# EAGLE schematic Hovercraft (EAGLE 9.3.0)
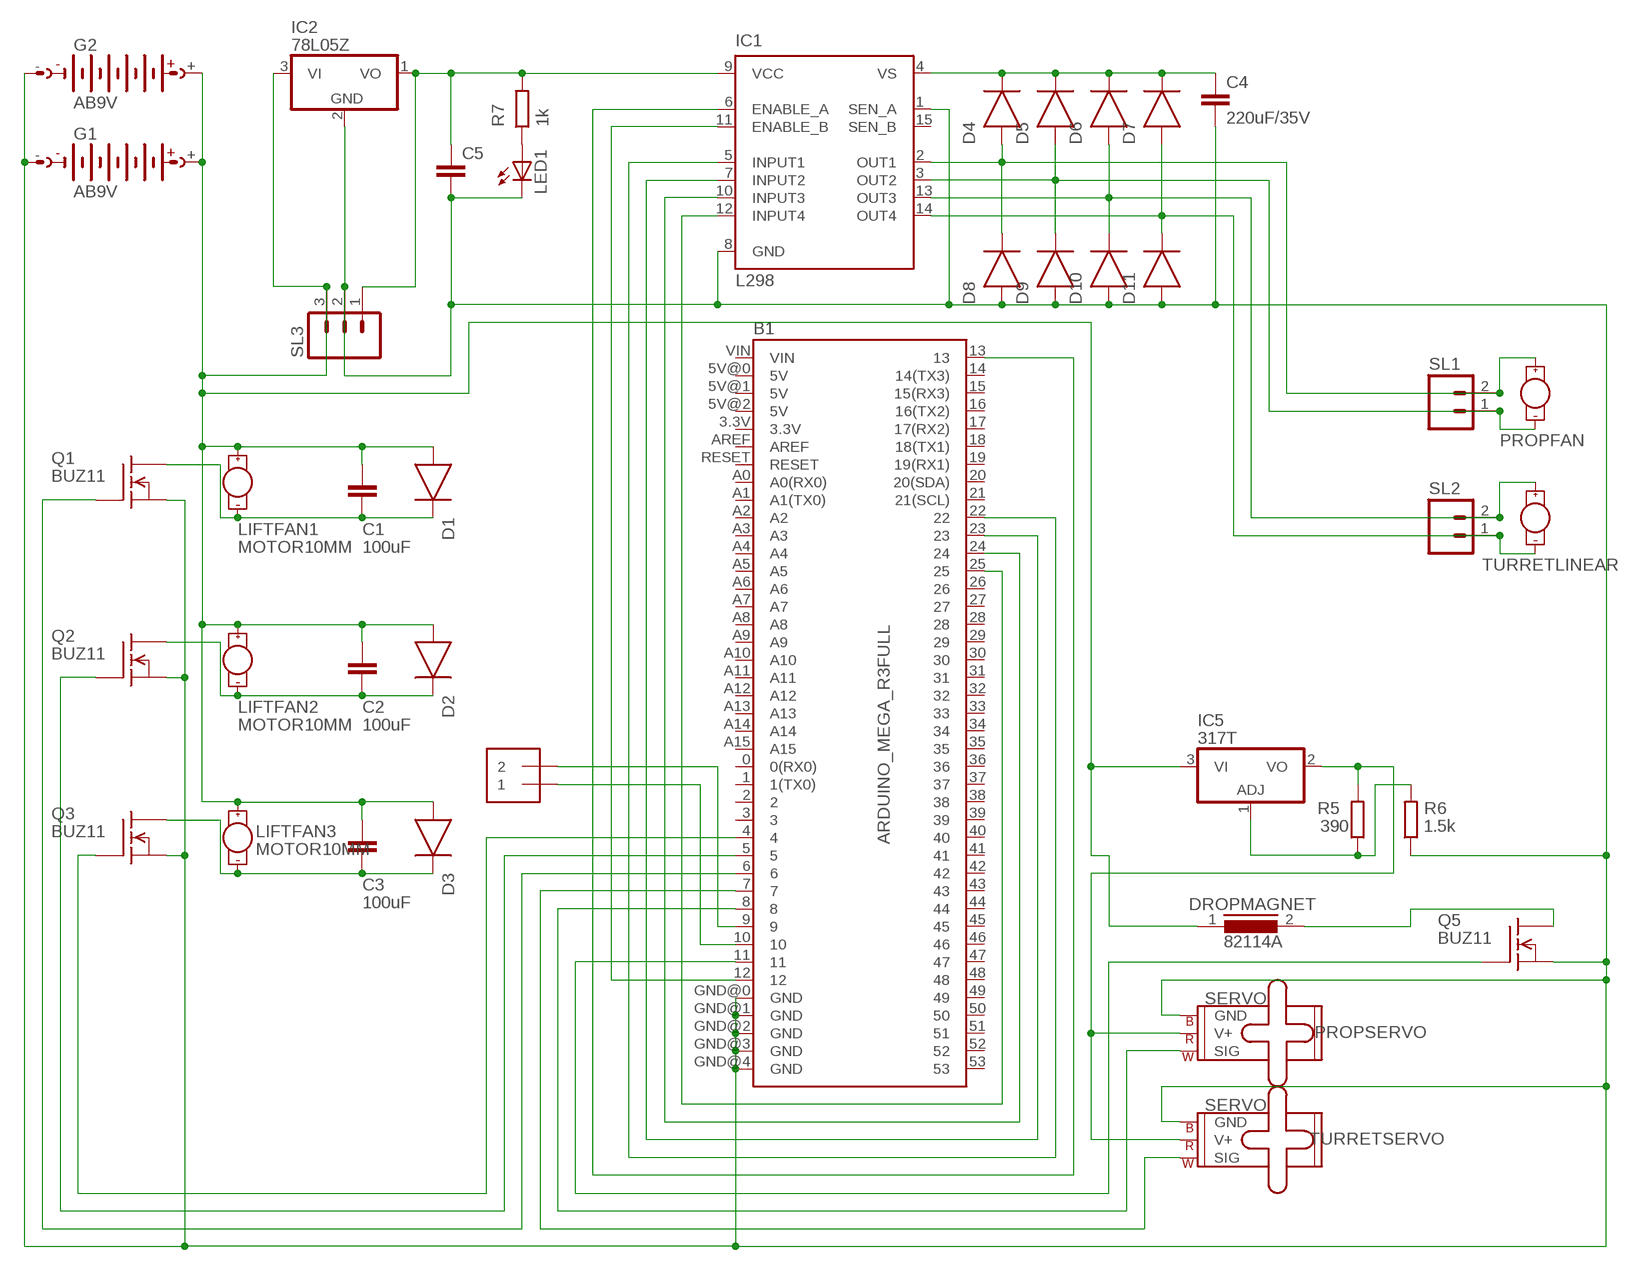
[diagram p0: schematic, sheet 1]

## Parts
B1  ARDUINO_MEGA_R3FULL  [ARDUINO_MEGA]
C1  100uF  C  (no package)
C2  100uF  C  (no package)
C3  100uF  C  (no package)
C4  220uF/35V  C2,5-3  [C2.5-3]
C5  C2,5-3  [C2.5-3]
D1  DIODE  (no package)
D2  DIODE  (no package)
D3  DIODE  (no package)
D4  DIODE  (no package)
D5  DIODE  (no package)
D6  DIODE  (no package)
D7  DIODE  (no package)
D8  DIODE  (no package)
D9  DIODE  (no package)
D10  DIODE  (no package)
D11  DIODE  (no package)
DROPMAGNET  82114A  [82114A]
G1  AB9V  [AB9V]
G2  AB9V  [AB9V]
HOSTSHIELD  1X2-3.5MM  [1X2-3.5MM]
IC1  L298  [MULTIWATT-15]
IC2  78L05Z  [TO92]
IC5  317T  [TO220H]
LED1  LED3MM  [LED3MM]
LIFTFAN1  MOTOR10MM  [VIBE-MOTOR-10MM]
LIFTFAN2  MOTOR10MM  [VIBE-MOTOR-10MM]
LIFTFAN3  MOTOR10MM  [VIBE-MOTOR-10MM]
PROPFAN  MOTOR10MM  [VIBE-MOTOR-10MM]
PROPSERVO  SERVO  [1X03]
Q1  BUZ11  [TO220]
Q2  BUZ11  [TO220]
Q3  BUZ11  [TO220]
Q5  BUZ11  [TO220]
R5  390  R  (no package)
R6  1.5k  R  (no package)
R7  1k  R  (no package)
SL1  M02  [02P]
SL2  M02  [02P]
SL3  M03  [03P]
TURRETLINEAR  MOTOR10MM  [VIBE-MOTOR-10MM]
TURRETSERVO  SERVO  [1X03]

## Nets
N$1: C4.1 D4.C D5.C D6.C D7.C IC1.4(VS)
N$2: C1.2 D1.C LIFTFAN1.- Q1.2(D)
N$3: B1.6 Q1.1(G)
N$4: C2.2 D2.C LIFTFAN2.- Q2.2(D)
N$5: IC5.2(VO) PROPSERVO.2(V+) R5.2 TURRETSERVO.2(V+)
N$6: C3.2 D3.C LIFTFAN3.- Q3.2(D)
N$7: D6.A D10.C IC1.13(OUT3) SL2.2 TURRETLINEAR.+
N$8: D5.A D9.C IC1.3(OUT2) PROPFAN.- SL1.1
N$9: D7.A D11.C IC1.14(OUT4) SL2.1 TURRETLINEAR.-
N$10: C1.1 C2.1 C3.1 D1.A D2.A D3.A DROPMAGNET.1 G1.+ G2.+ IC2.3(VI) IC5.3(VI) LIFTFAN1.+ LIFTFAN2.+ LIFTFAN3.+ SL3.3
N$11: B1.GND@0(GND) B1.GND@1(GND) B1.GND@2(GND) B1.GND@3(GND) B1.GND@4(GND) C4.2 C5.2 D8.A D9.A D10.A D11.A G1.- G2.- IC1.1(SEN_A) IC1.8(GND) IC2.2(GND) LED1.K(C) PROPSERVO.3(GND) Q1.3(S) Q2.3(S) Q3.3(S) Q5.3(S) R6.1 SL3.2 TURRETSERVO.3(GND)
N$12: C5.1 IC1.9(VCC) IC2.1(VO) R7.2 SL3.1
N$13: B1.23 IC1.7(INPUT2)
N$14: D4.A D8.C IC1.2(OUT1) PROPFAN.+ SL1.2
N$15: B1.22 IC1.5(INPUT1)
N$16: B1.13 IC1.6(ENABLE_A)
N$17: B1.5 Q2.1(G)
N$18: B1.4 Q3.1(G)
N$19: B1.7 TURRETSERVO.1(SIG)
N$20: B1.8 PROPSERVO.1(SIG)
N$21: B1.12 IC1.11(ENABLE_B)
N$22: B1.24 IC1.10(INPUT3)
N$23: DROPMAGNET.2 Q5.2(D)
N$24: B1.11 Q5.1(G)
N$26: B1.10 HOSTSHIELD.1
N$27: B1.9 HOSTSHIELD.2
N$28: B1.25 IC1.12(INPUT4)
N$31: LED1.A R7.1
N$35: IC5.1(ADJ) R5.1 R6.2
Unconnected: B1.0(0(RX0)) B1.1(1(TX0)) B1.2 B1.3 B1.3.3V B1.5V@0(5V) B1.5V@1(5V) B1.5V@2(5V) B1.14(14(TX3)) B1.15(15(RX3)) B1.16(16(TX2)) B1.17(17(RX2)) B1.18(18(TX1)) B1.19(19(RX1)) B1.20(20(SDA)) B1.21(21(SCL)) B1.26 B1.27 B1.28 B1.29 B1.30 B1.31 B1.32 B1.33 B1.34 B1.35 B1.36 B1.37 B1.38 B1.39 B1.40 B1.41 B1.42 B1.43 B1.44 B1.45 B1.46 B1.47 B1.48 B1.49 B1.50 B1.51 B1.52 B1.53 B1.A0(A0(RX0)) B1.A1(A1(TX0)) B1.A2 B1.A3 B1.A4 B1.A5 B1.A6 B1.A7 B1.A8 B1.A9 B1.A10 B1.A11 B1.A12 B1.A13 B1.A14 B1.A15 B1.AREF B1.RESET B1.VIN IC1.15(SEN_B)

## Library data of the parts
B1 = SparkFun-Boards:ARDUINO_MEGA_R3: Arduino Mega R3 ATmega2560 R3 compatible footprint. SparkFun Products: Arduino Mega 2560 R3 <https://www.sparkfun.com/products/11061>
C1-C3 = ngspice-simulation:C: CAPACITOR naming: grid - package width
C4 C5 = capacitor-wima:C: CAPACITOR naming: grid - package width
D1-D11 = ngspice-simulation:DIODE: Diode
DROPMAGNET = inductors:82114A: INDUCTOR; SPICEPREFIX: L
G1 G2 = battery:AB9V: 9-V BATTERY CLIP
HOSTSHIELD = adafruit:1X2: 3.5mm Terminal block http://www.ladyada.net/library/pcb/eaglelibrary.html
IC1 = st-microelectronics:L298: DUAL FULL-BRIDGE DRIVER; MPN: L298N; OC_FARNELL: 1589425; OC_NEWARK: 32M1527
IC2 = linear:78*: Positive VOLTAGE REGULATOR Source: http://cache.national.com/ds/LM/LM78L05.pdf http://www.fairchildsemi.com/ds/LM/LM7805.pdf
IC5 = linear:*317: Positive VOLTAGE REGULATOR
LED1 = adafruit:LED: LED OSRAM: - CHIPLED LG R971, LG N971, LY N971, LG Q971, LY Q971, LO R971, LY R971 LH N974, LH R974 LS Q976, LO Q976, LY Q976 LO Q996 - Hyper CHIPLED LW Q18S LB Q993, LB Q99A, LB R99A - SideLED LS A670, LO A670, LY A670, LG A670, LP A670 LB A673, LV A673, LT A673, LW A673 LH A674 LY A675 LS A676, LA A676, LO A676, LY A676, LW A676 LS A679, LY A679, LG A679 - Hyper Micro SIDELED® LS Y876, LA Y876, LO Y876, LY Y876 LT Y87S - SmartLED LW L88C, LW L88S LB L89C, LB L89S, LG L890 LS L89K, LO L89K, LY L89K LS L896, LA L896, LO L896, LY L896 - TOPLED LS T670, LO T670, LY T670, LG T670, LP T670 LSG T670, LSP T670, LSY T670, LOP T670, LYG T670 LG T671, LOG T671, LSG T671 LB T673, LV T673, LT T673, LW T673 LH T674 LS T676, LA T676, LO T676, LY T676, LB T676, LH T676, LSB T676, LW T676 LB T67C, LV T67C, LT T67C, LS T67K, LO T67K, LY T67K, LW E67C LS E67B, LA E67B, LO E67B, LY E67B, LB E67C, LV E67C, LT E67C LW T67C LS T679, LY T679, LG T679 LS T770, LO T770, LY T770, LG T770, LP T770 LB T773, LV T773, LT T773, LW T773 LH T774 LS E675, LA E675, LY E675, LS T675 LS T776, LA T776, LO T776, LY T776, LB T776 LHGB T686 LT T68C, LB T68C - Hyper Mini TOPLED® LB M676 - Mini TOPLED Santana® LG M470 LS M47K, LO M47K, LY M47K Source: http://www.osram.convergy.de/
LIFTFAN1 PROPFAN TURRETLINEAR = SparkFun-Electromechanical:MOTOR: Motor (Single-Phase) Two-terminal, single-phase motors. SparkFun Products Vibration Motor <https://www.sparkfun.com/products/8449> (ROB-08449) Physical dimension and wire connections for this powerful vibration motor. Motor has a self adhesive backing.; PROD_ID: COMP-08572; SF_SKU: ROB-08449; SPICEPREFIX: B
LIFTFAN2 LIFTFAN3 = SparkFun-Electromechanical:MOTOR: Motor (Single-Phase) Two-terminal, single-phase motors. SparkFun Products Vibration Motor <https://www.sparkfun.com/products/8449> (ROB-08449) Physical dimension and wire connections for this powerful vibration motor. Motor has a self adhesive backing.; PROD_ID: COMP-08572; SF_SKU: ROB-08449
PROPSERVO TURRETSERVO = SparkFun-Electromechanical:SERVO: Servo Motor 3-pin connector for a standard servo motor (voltage supply, ground, and control signal.) SparkFun Products Servo - Generic (Sub-Micro Size) <https://www.sparkfun.com/products/9065> (ROB-09065) Servo - Generic High Torque Continuous Rotation (Standard Size) <https://www.sparkfun.com/products/9347> (ROB-09347) Servo - Generic High Torque (Standard Size) <https://www.sparkfun.com/products/11965> (ROB-11965)
Q1-Q3 Q5 = transistor-fet:BUZ11: N-Channel Enhancement MOSFET 50V; 30A; 0,040Ohm
R5-R7 = ngspice-simulation:R: RESISTOR
SL1 SL2 = con-amp-quick:M02: AMP QUICK CONNECTOR; OC_FARNELL: unknown; OC_NEWARK: unknown
SL3 = con-amp-quick:M03: AMP QUICK CONNECTOR; OC_FARNELL: unknown; OC_NEWARK: unknown